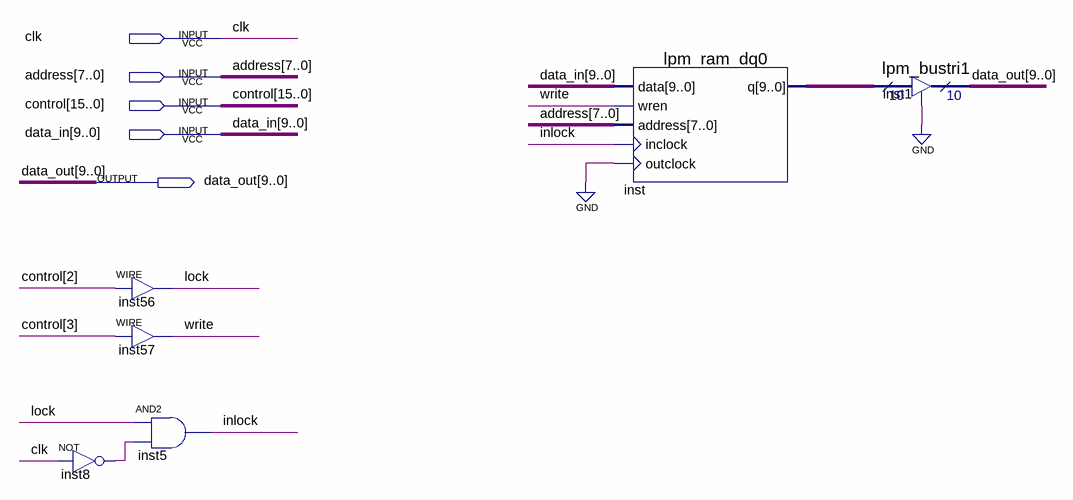
[diagram p0: schematic sheet]
// Quartus schematic RAM.bdf as structural Verilog: 6 symbols, 5 pins
module RAM (
  input  clk,
  input  [7:0] address,
  input  [15:0] control,
  input  [9:0] data_in,
  output [9:0] data_out
);

  wire inlock, inst8_out, lock, write;
  wire [9:0] inst_q;

  not inst8 (inst8_out, clk);
  assign lock = control[2];  // WIRE inst56
  assign write = control[3];  // WIRE inst57
  and inst5 (inlock, lock, inst8_out);
  lpm_ram_dq0 inst (.data(data_in), .wren(write), .address(address), .inclock(inlock), .outclock(1'b0), .q(inst_q));
  lpm_bustri1 inst1 (.enabledt(1'b0), .data(inst_q), .tridata(data_out));
endmodule
